# EAGLE schematic 00A-005 Fuse Post Board (EAGLE 6.3)
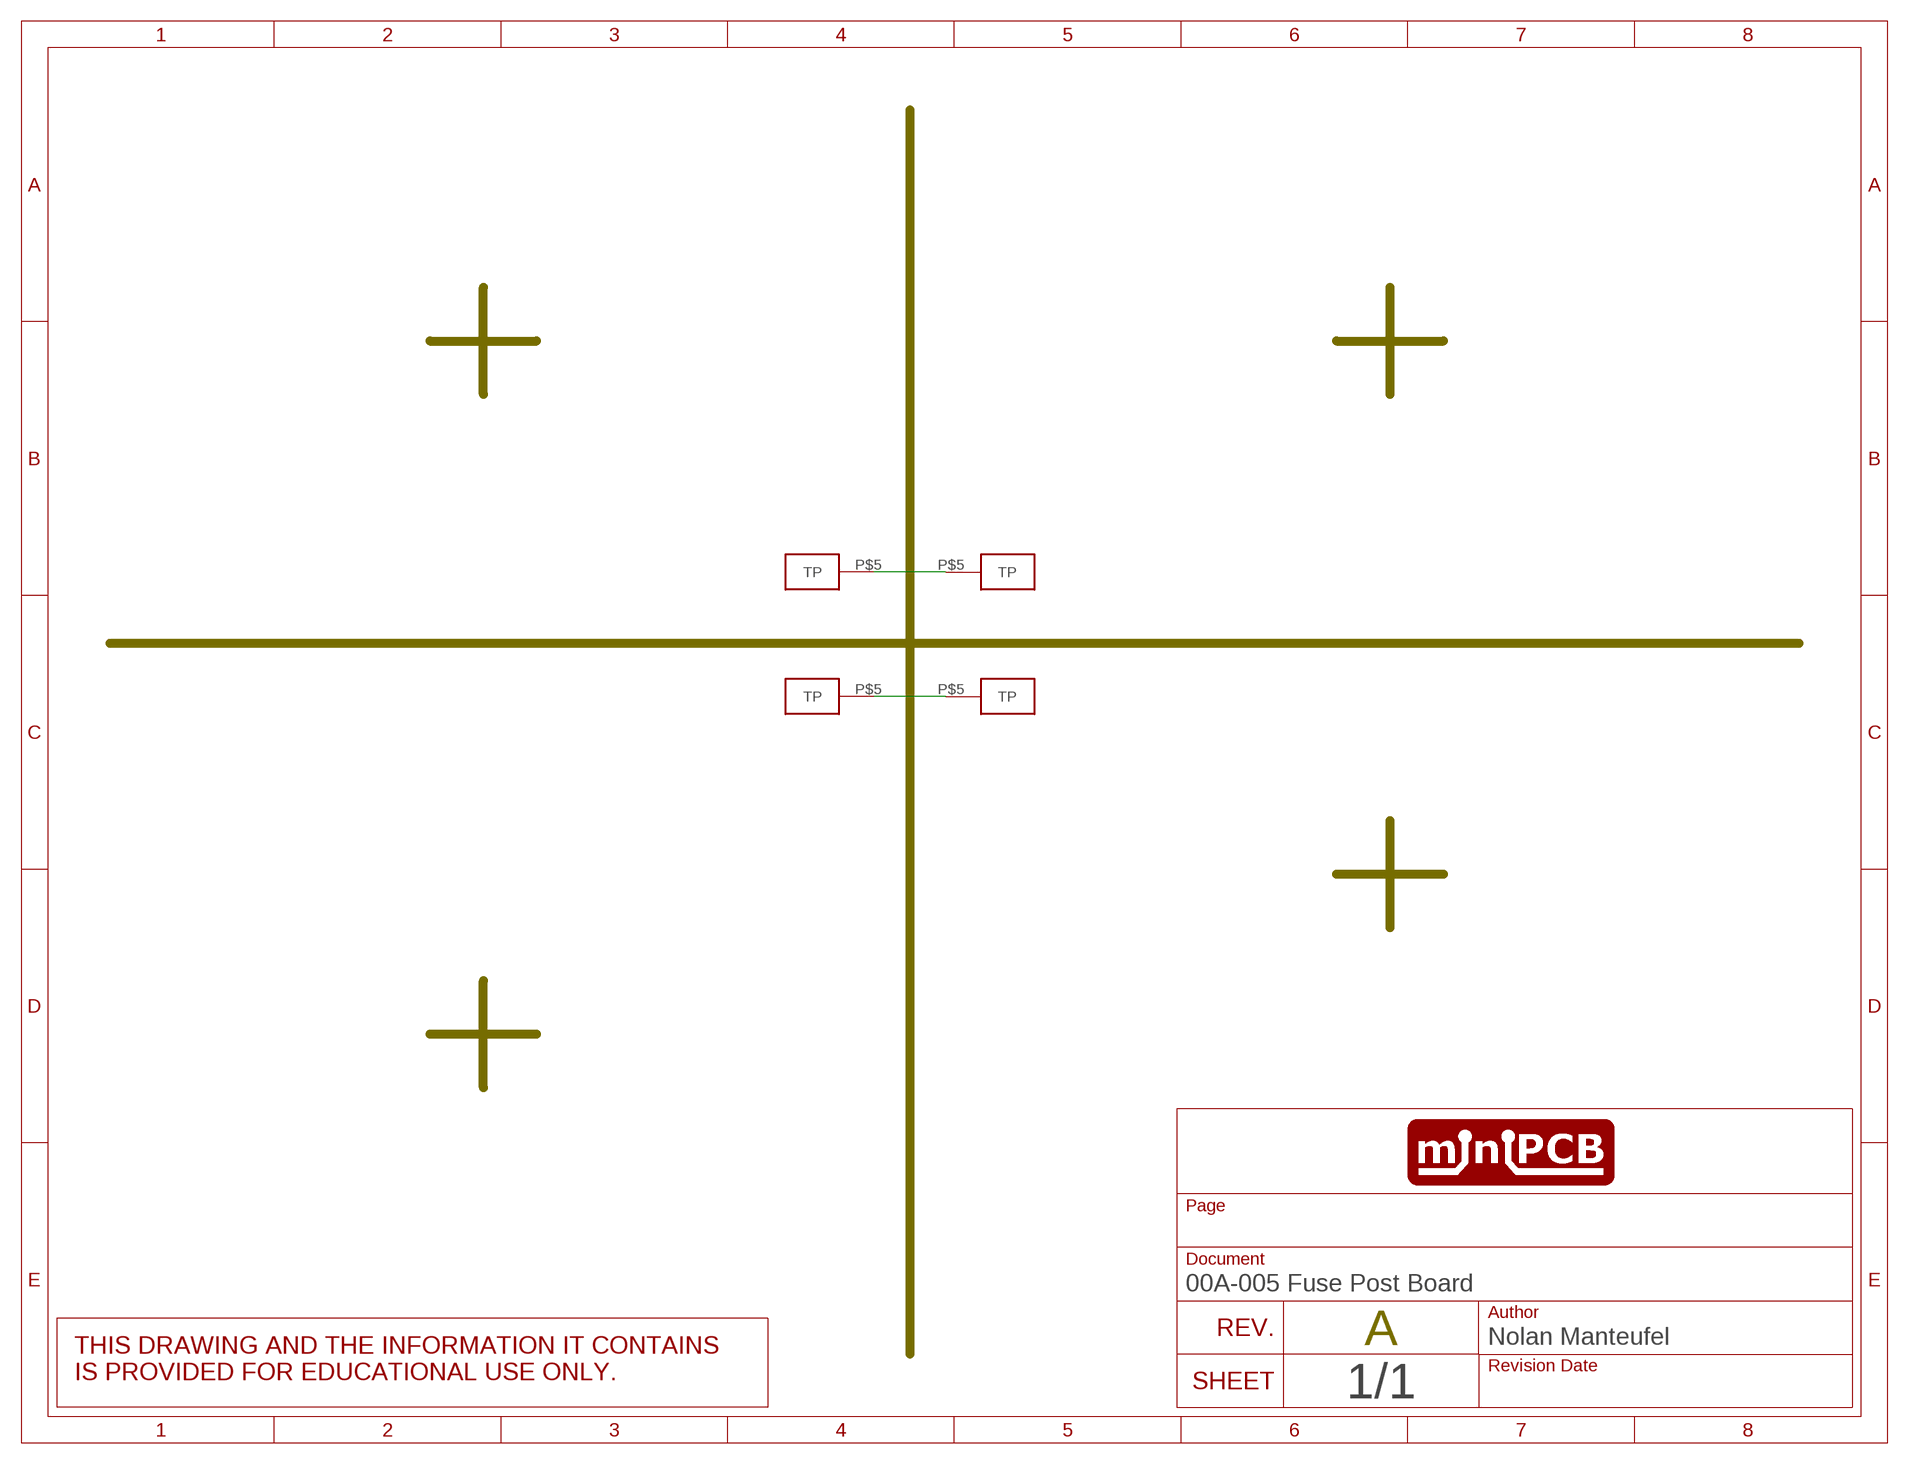
[diagram p0: schematic, sheet 1]

## Parts
U$1  TESTPOINT2M4  [SCREW_TERMINAL_M4]
U$2  TESTPOINT2M4  [SCREW_TERMINAL_M4]
U$3  TESTPOINT2M4  [SCREW_TERMINAL_M4]
U$4  TESTPOINT2M4  [SCREW_TERMINAL_M4]

## Nets
N$1: U$1.P$5(TP) U$3.P$5(TP)
N$2: U$2.P$5(TP) U$4.P$5(TP)

## Library data of the parts
U$1-U$4 = nolan:TESTPOINT2